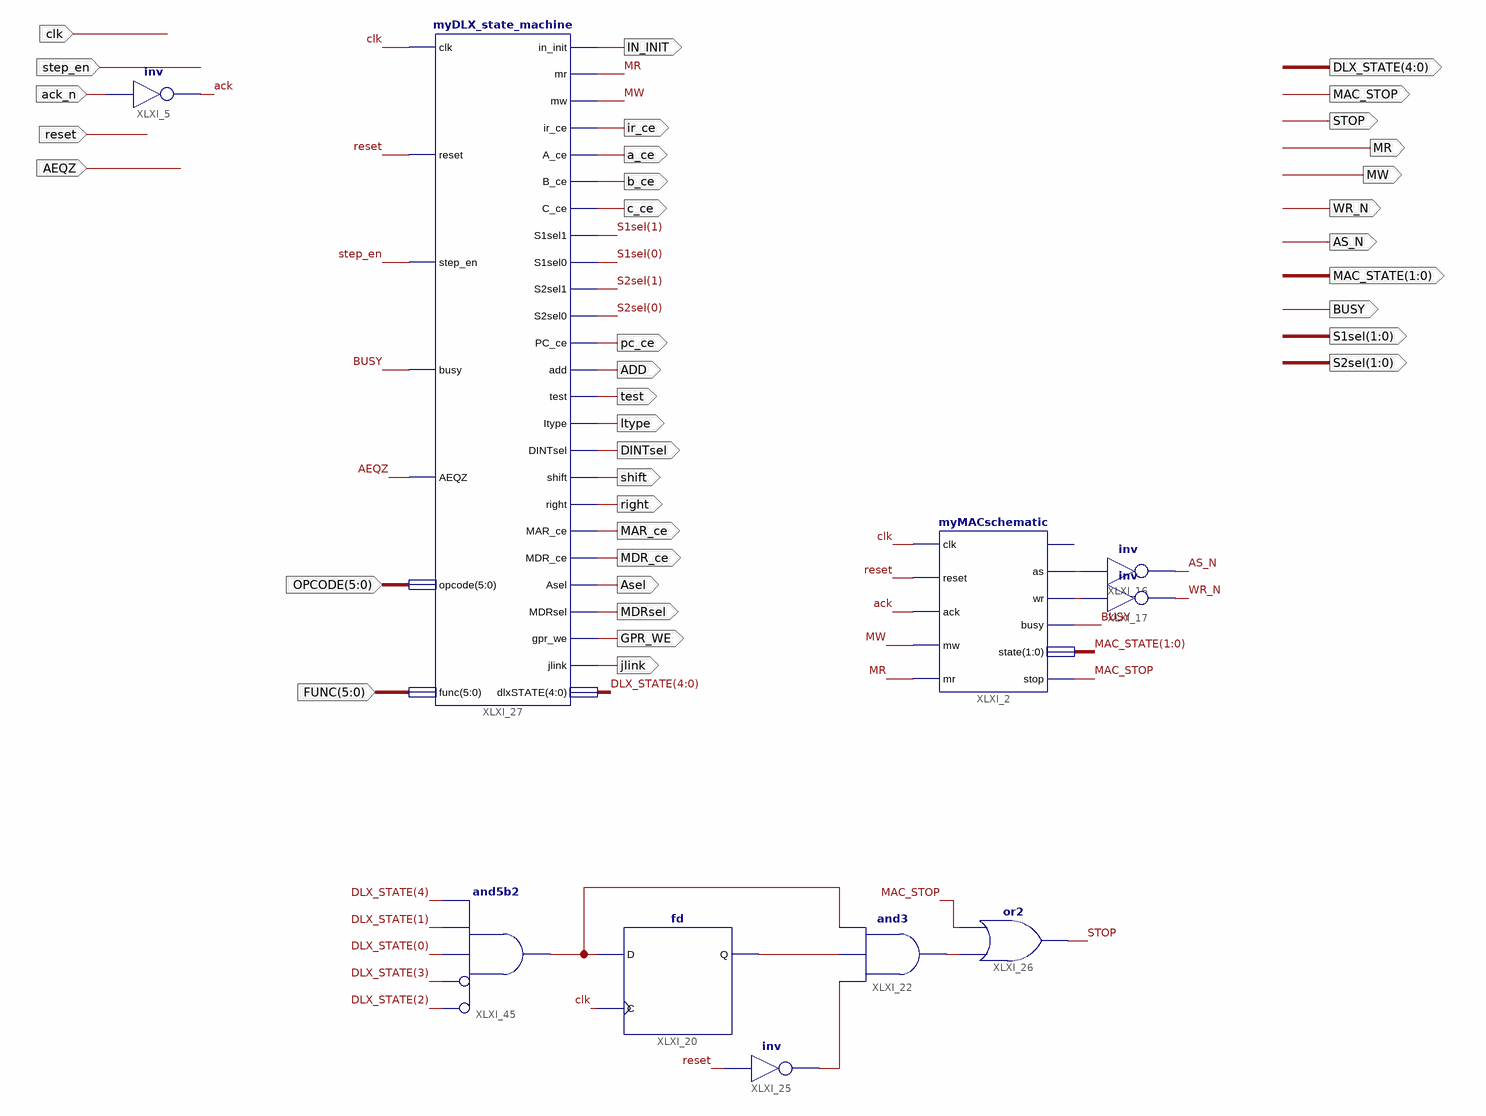
[diagram p0: schematic sheet 1]
// Xilinx ISE schematic DLXcontrolSchematic.sch (spartan2) as structural Verilog: 10 symbols, 36 ports
module DLXcontrolSchematic (
  input  clk,
  input  step_en,
  input  reset,
  input  AEQZ,
  input  ack_n,
  input  [5:0] FUNC,
  input  [5:0] OPCODE,
  output WR_N,
  output STOP,
  output BUSY,
  output MR,
  output MW,
  output MAC_STOP,
  output AS_N,
  output IN_INIT,
  output [4:0] DLX_STATE,
  output ir_ce,
  output b_ce,
  output c_ce,
  output a_ce,
  output pc_ce,
  output ADD,
  output test,
  output Itype,
  output DINTsel,
  output shift,
  output right,
  output MAR_ce,
  output MDR_ce,
  output Asel,
  output MDRsel,
  output GPR_WE,
  output jlink,
  output [1:0] MAC_STATE,
  output [1:0] S1sel,
  output [1:0] S2sel
);

  wire ack, XLXN_25, XLXN_145, XLXN_219, XLXN_221, XLXN_223, XLXN_304;

  not XLXI_5 (ack, ack_n);
  myDLX_state_machine XLXI_27 (
    .clk(clk), .reset(reset), .step_en(step_en), .busy(BUSY), .AEQZ(AEQZ), .opcode(OPCODE), .func(FUNC),
    .in_init(IN_INIT), .mr(MR), .mw(MW), .ir_ce(ir_ce), .A_ce(a_ce), .B_ce(b_ce), .C_ce(c_ce),
    .S1sel1(S1sel[1]), .S1sel0(S1sel[0]), .S2sel1(S2sel[1]), .S2sel0(S2sel[0]), .PC_ce(pc_ce), .add(ADD),
    .test(test), .Itype(Itype), .DINTsel(DINTsel), .shift(shift), .right(right), .MAR_ce(MAR_ce),
    .MDR_ce(MDR_ce), .Asel(Asel), .MDRsel(MDRsel), .gpr_we(GPR_WE), .jlink(jlink), .dlxSTATE(DLX_STATE));
  fd XLXI_20 (.C(clk), .D(XLXN_304), .Q(XLXN_219));
  and XLXI_22 (XLXN_223, XLXN_221, XLXN_219, XLXN_304);
  not XLXI_25 (XLXN_221, reset);
  or XLXI_26 (STOP, XLXN_223, MAC_STOP);
  and XLXI_45 (XLXN_304, ~DLX_STATE[2], ~DLX_STATE[3], DLX_STATE[0], DLX_STATE[1], DLX_STATE[4]);  // and5b2
  not XLXI_16 (AS_N, XLXN_145);
  not XLXI_17 (WR_N, XLXN_25);
  myMACschematic XLXI_2 (
    .clk(clk), .reset(reset), .ack(ack), .mw(MW), .mr(MR), .as(XLXN_145), .wr(XLXN_25), .busy(BUSY),
    .state(MAC_STATE), .stop(MAC_STOP));  // open: req
endmodule
